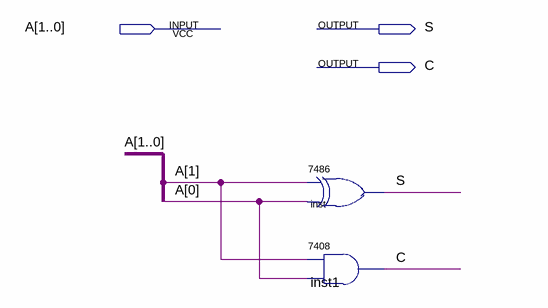
[diagram p0: schematic sheet]
// Quartus schematic Lab04_1_Half_Adder.bdf as structural Verilog: 2 symbols, 3 pins
module Lab04_1_Half_Adder (
  input  [1:0] A,
  output S,
  output C
);

  \7486  inst (.\2 (A[1]), .\3 (A[0]), .\1 (S));
  \7408  inst1 (.\3 (A[0]), .\2 (A[1]), .\1 (C));
endmodule
